# EAGLE schematic dcc-promini (EAGLE 6.6.0)
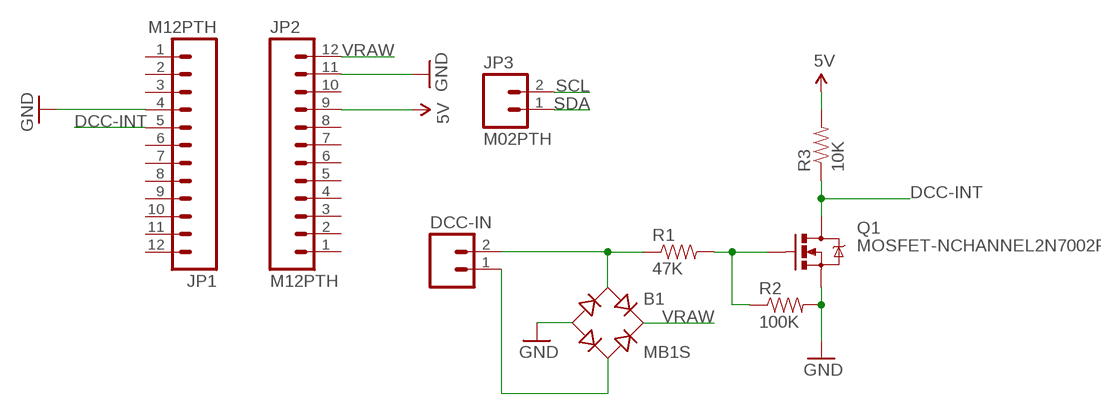
[diagram p0: schematic, sheet 1]

## Parts
B1  MB1S  [SOIC-4]
DCC-IN  M02-JST-2-PTH-NO_SILK  [JST-2-PTH-NS]
JP1  M12PTH  [1X12]
JP2  M12PTH  [1X12]
JP3  M02PTH  [1X02]
Q1  MOSFET-NCHANNEL2N7002PW  [SOT323]
R1  47K  RESISTOR0603-RES  [0603-RES]
R2  100K  RESISTOR0603-RES  [0603-RES]
R3  10K  RESISTOR0603-RES  [0603-RES]

## Nets
5V: JP2.9 R3.2
DCC-INT: JP1.5 Q1.3(D) R3.1
GND: B1.- JP1.4 JP2.11 Q1.2(S) R2.2
N$1: Q1.1(G) R1.2 R2.1
N$3: B1.~1(AC1) DCC-IN.2 R1.1
N$4: B1.~2(AC2) DCC-IN.1
SCL: JP3.2
SDA: JP3.1
VRAW: B1.+ JP2.12
Unconnected: JP1.1 JP1.2 JP1.3 JP1.6 JP1.7 JP1.8 JP1.9 JP1.10 JP1.11 JP1.12 JP2.1 JP2.2 JP2.3 JP2.4 JP2.5 JP2.6 JP2.7 JP2.8 JP2.10

## Library data of the parts
B1 = rectifier:MB*S: Bridge Rectifier Source: http://www.fairchildsemi.com/ds/MB/MB6S.pdf
DCC-IN JP3 = SparkFun-Connectors:M02: Standard 2-pin 0.1" header. Use with - straight break away headers ( PRT-00116) - right angle break away headers (PRT-00553) - swiss pins (PRT-00743) - machine pins (PRT-00117) - female headers (PRT-00115) Molex polarized connector foot print use with: PRT-08233 with associated crimp pins and housings. 2.54_SCREWTERM for use with PRT-10571. 3.5mm Screw Terminal footprints for PRT-08084 5mm Screw Terminal footprints for use with PRT-08433
JP1 JP2 = SparkFun-Connectors:M12: Header 12 Standard 12-pin 0.1" header. Use with straight break away headers (SKU : PRT-00116), right angle break away headers (PRT-00553), swiss pins (PRT-00743), machine pins (PRT-00117), and female headers (PRT-00115).
Q1 = SparkFun-DiscreteSemi:MOSFET-NCHANNEL: Common NMOSFET Parts MFG P/N Store ID Prod ID FDD8780 TRANS-09984 SI7820DN TRANS-11055 FDS6630A IC-08089 2N7002PW TRANS-11151 FQP30N06L COM-10213 TRANS-10060 BSS123LT1G TRANS-08345 BSS138 TRANS-00830 BS170 2N7000; PROD_ID: TRANS-11151
R1-R3 = SparkFun-Passives:RESISTOR: Resistor Basic schematic elements and footprints for 0603, 1206, and PTH resistors.